# EAGLE design PAPx2-44 (EAGLE 7.2.0)
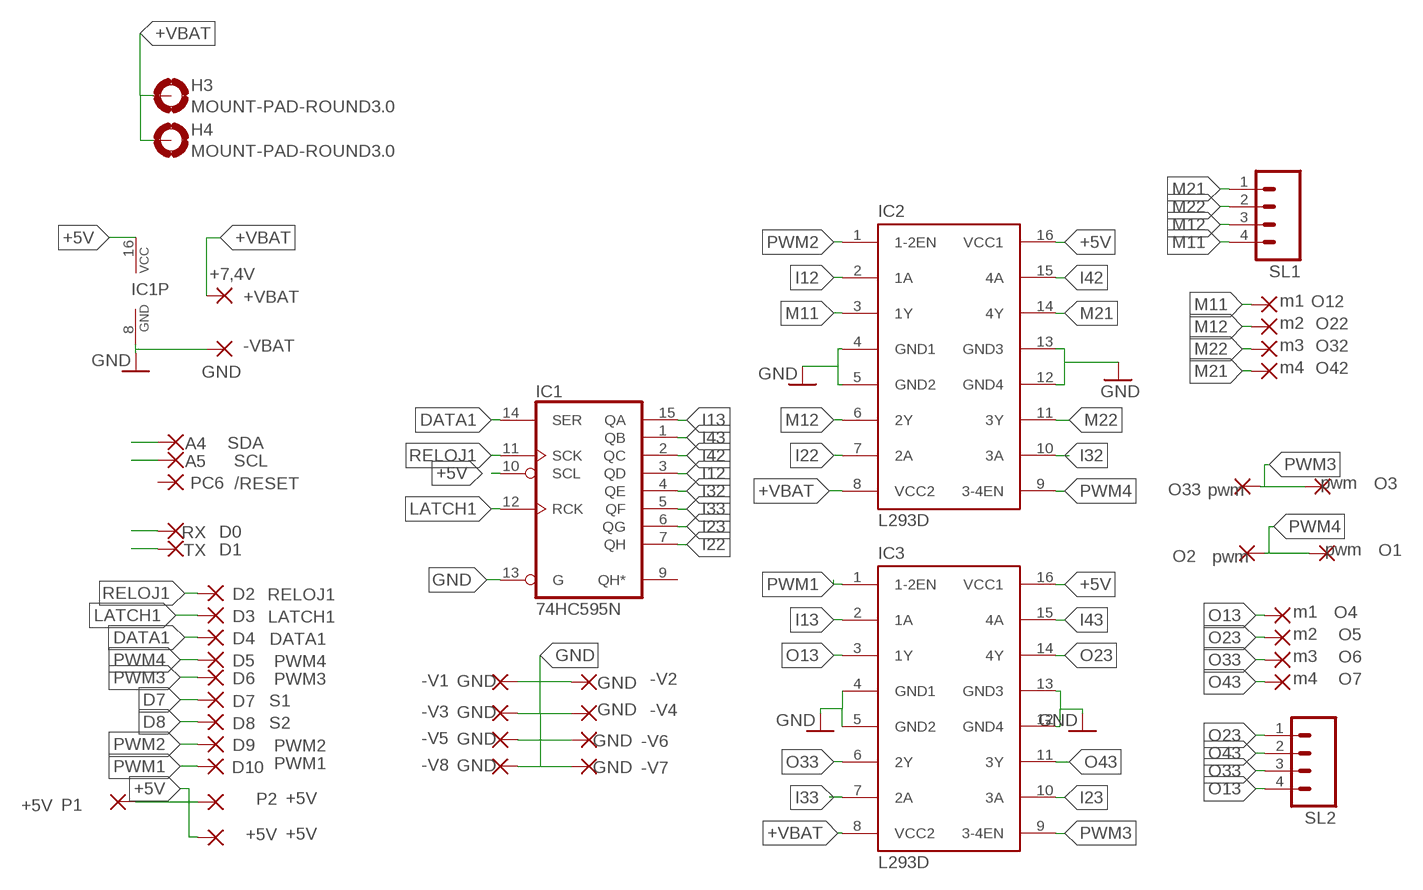
[diagram p0: schematic, sheet 1]

## Parts
+5V  +5V  WIREPAD1,6/0,8  [1,6/0,8]
+VBAT  +7,4V  WIREPAD1,6/0,8  [1,6/0,8]
-V1  GND  WIREPAD1,6/0,8  [1,6/0,8]
-V2  GND  WIREPAD1,6/0,8  [1,6/0,8]
-V3  GND  WIREPAD1,6/0,8  [1,6/0,8]
-V4  GND  WIREPAD1,6/0,8  [1,6/0,8]
-V5  GND  WIREPAD1,6/0,8  [1,6/0,8]
-V6  GND  WIREPAD1,6/0,8  [1,6/0,8]
-V7  GND  WIREPAD1,6/0,8  [1,6/0,8]
-V8  GND  WIREPAD1,6/0,8  [1,6/0,8]
-VBAT  GND  WIREPAD1,6/0,8  [1,6/0,8]
/RESET  PC6  WIREPAD1,6/0,8  [1,6/0,8]
A4  SDA  WIREPAD1,6/0,8  [1,6/0,8]
A5  SCL  WIREPAD1,6/0,8  [1,6/0,8]
D7  S1  WIREPAD1,6/0,8  [1,6/0,8]
D8  S2  WIREPAD1,6/0,8  [1,6/0,8]
DATA1  D4  WIREPAD1,6/0,8  [1,6/0,8]
H3  MOUNT-PAD-ROUND3.0  [3,0-PAD]
H4  MOUNT-PAD-ROUND3.0  [3,0-PAD]
IC1  74HC595N  [DIL16]
IC2  L293D  [DIL16]
IC3  L293D  [DIL16]
LATCH1  D3  WIREPAD1,6/0,8  [1,6/0,8]
O1  pwm  WIREPAD1,6/0,8  [1,6/0,8]
O2  pwm  WIREPAD1,6/0,8  [1,6/0,8]
O3  pwm  WIREPAD1,6/0,8  [1,6/0,8]
O4  m1  WIREPAD1,6/0,8  [1,6/0,8]
O5  m2  WIREPAD1,6/0,8  [1,6/0,8]
O6  m3  WIREPAD1,6/0,8  [1,6/0,8]
O7  m4  WIREPAD1,6/0,8  [1,6/0,8]
O12  m1  WIREPAD1,6/0,8  [1,6/0,8]
O22  m2  WIREPAD1,6/0,8  [1,6/0,8]
O32  m3  WIREPAD1,6/0,8  [1,6/0,8]
O33  pwm  WIREPAD1,6/0,8  [1,6/0,8]
O42  m4  WIREPAD1,6/0,8  [1,6/0,8]
P1  +5V  WIREPAD1,6/0,8  [1,6/0,8]
P2  +5V  WIREPAD1,6/0,8  [1,6/0,8]
PWM1  D10  WIREPAD1,6/0,8  [1,6/0,8]
PWM2  D9  WIREPAD1,6/0,8  [1,6/0,8]
PWM3  D6  WIREPAD1,6/0,8  [1,6/0,8]
PWM4  D5  WIREPAD1,6/0,8  [1,6/0,8]
RELOJ1  D2  WIREPAD1,6/0,8  [1,6/0,8]
RX  D0  WIREPAD1,6/0,8  [1,6/0,8]
SL1  M04  [04P]
SL2  M04  [04P]
TX  D1  WIREPAD1,6/0,8  [1,6/0,8]

## Nets
+5V: +5V.1(P) IC1.10(SCL) IC1.16(VCC) IC2.16(VCC1) IC3.16(VCC1) P1.1(P) P2.1(P)
+VBAT: +VBAT.1(P) H3.B3,0(MOUNT) H4.B3,0(MOUNT) IC2.8(VCC2) IC3.8(VCC2)
D7: D7.1(P)
D8: D8.1(P)
DATA1: DATA1.1(P) IC1.14(SER)
GND: -V1.1(P) -V2.1(P) -V3.1(P) -V4.1(P) -V5.1(P) -V6.1(P) -V7.1(P) -V8.1(P) -VBAT.1(P) IC1.8(GND) IC1.13(G) IC2.4(GND1) IC2.5(GND2) IC2.12(GND4) IC2.13(GND3) IC3.12(GND4) IC3.13(GND3)
I12: IC1.3(QD) IC2.2(1A)
I13: IC1.15(QA) IC3.2(1A)
I22: IC1.7(QH) IC2.7(2A)
I23: IC1.6(QG) IC3.10(3A)
I32: IC1.4(QE) IC2.10(3A)
I33: IC1.5(QF) IC3.7(2A)
I42: IC1.2(QC) IC2.15(4A)
I43: IC1.1(QB) IC3.15(4A)
LATCH1: IC1.12(RCK) LATCH1.1(P)
M11: IC2.3(1Y) O12.1(P) SL1.4
M12: IC2.6(2Y) O22.1(P) SL1.3
M21: IC2.14(4Y) O42.1(P) SL1.1
M22: IC2.11(3Y) O32.1(P) SL1.2
N$1: RX.1(P)
N$2: TX.1(P)
N$3: IC3.4(GND1) IC3.5(GND2) ; supply symbol labelled GND
N$5: A4.1(P)
N$6: A5.1(P)
O13: IC3.3(1Y) O4.1(P) SL2.4
O23: IC3.14(4Y) O5.1(P) SL2.1
O33: IC3.6(2Y) O6.1(P) SL2.3
O43: IC3.11(3Y) O7.1(P) SL2.2
PWM1: IC3.1(1-2EN) PWM1.1(P)
PWM2: IC2.1(1-2EN) PWM2.1(P)
PWM3: IC3.9(3-4EN) O3.1(P) O33.1(P) PWM3.1(P)
PWM4: IC2.9(3-4EN) O1.1(P) O2.1(P) PWM4.1(P)
RELOJ1: IC1.11(SCK) RELOJ1.1(P)
Unconnected: /RESET.1(P) IC1.9(QH*)

## Library data of the parts
+5V +VBAT -V1--V8 -VBAT /RESET A4 A5 D7 D8 DATA1 LATCH1 O1-O7 O12 O22 O32 O33 O42 P1 P2 PWM1-PWM4 RELOJ1 RX TX = wirepad:WIREPAD: Wire PAD connect wire on PCB
H3 H4 = holes:MOUNT-PAD-ROUND: MOUNTING PAD, round
IC1 = 74xx-eu:74*595: 8-bit SHIFT REGISTER, output latch
IC2 IC3 = treser_lib:L293D: Driver L293D Driver PUSH-PULL de 4 canales; MPN: L293D; OC_FARNELL: 9589619; OC_NEWARK: 56P8249
SL1 SL2 = con-amp-quick:M04: AMP QUICK CONNECTOR; OC_FARNELL: unknown; OC_NEWARK: unknown

## Board
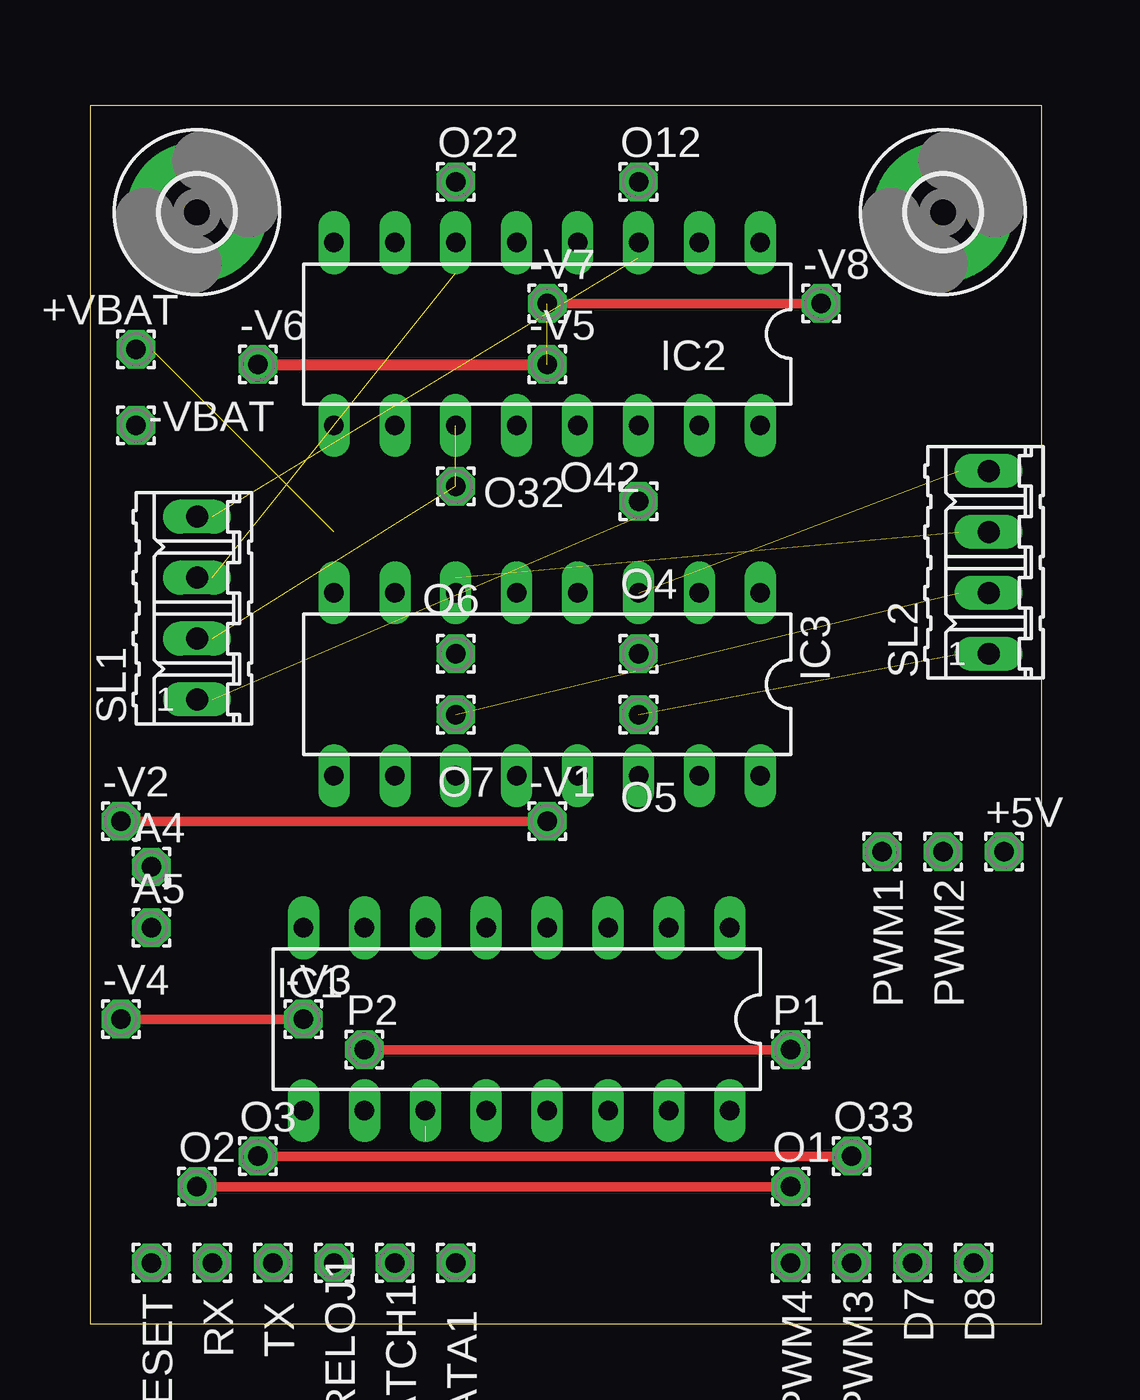
[diagram p1: board, top side]
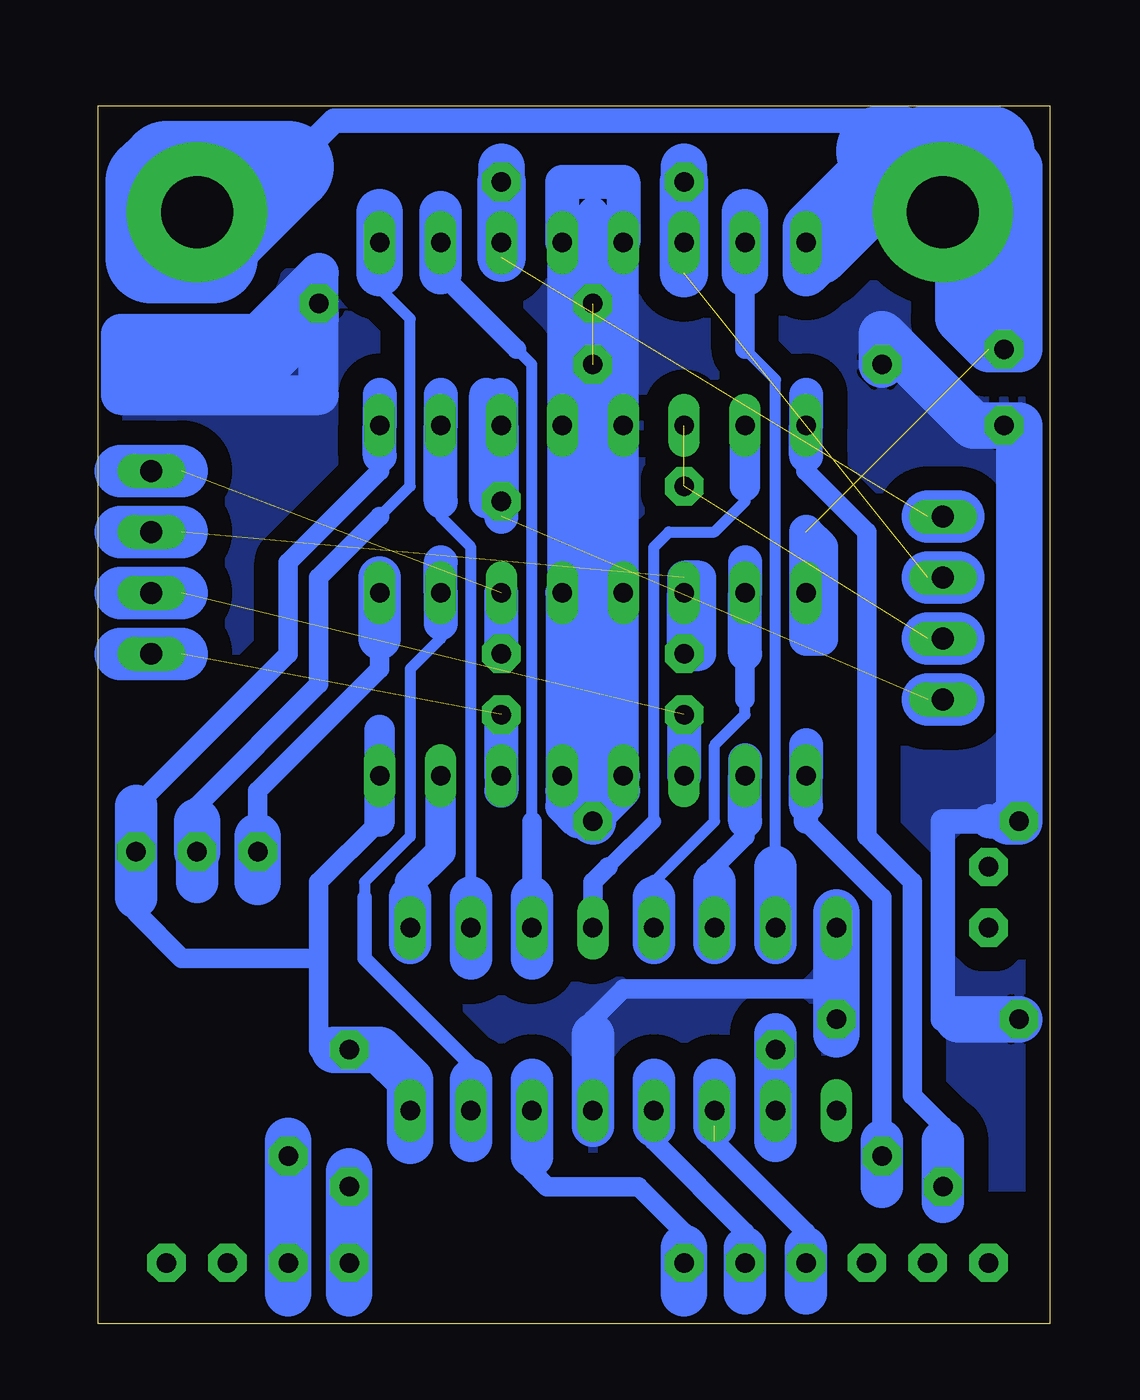
[diagram p2: board, bottom side, seen from below]

Size 39.67 x 50.79 mm. Coordinates in mm from the lower left corner, seen from the top.
Outline: 0,0 39.67,0 39.67,50.79 0,50.79 0,0
Copper layers (1*16): Top 0.035mm / dielectric 1.5mm / Bottom 0.035mm
Design rules "default": minimum track width 10mil, minimum drill 24mil, track to track 8mil, track to pad 8mil, pad to pad 8mil, via to via 8mil, smd to smd 8mil, copper to edge 40mil, drill to drill 8mil, minimum pad ring 10mil, minimum via ring 8mil, stop-mask expansion 4mil, vias tented up to drill 0mil, thermal gap 10mil

### Footprints (pad centres in the part's own frame; a part is rotated, then mirrored left to right if it is on the bottom)
1,6/0,8 = drill 0.813 pad 1.6 octagon: 1 0,0
3,0-PAD = drill 3 pad 5.842: B3,0 0,0
DIL16 = drill 0.813 long: 1 -8.89,-3.81; 2 -6.35,-3.81; 3 -3.81,-3.81; 4 -1.27,-3.81; 5 1.27,-3.81; 6 3.81,-3.81; 7 6.35,-3.81; 8 8.89,-3.81; 9 8.89,3.81; 10 6.35,3.81; 11 3.81,3.81; 12 1.27,3.81; 13 -1.27,3.81; 14 -3.81,3.81; 15 -6.35,3.81; 16 -8.89,3.81
04P = drill 0.914 long: 1 -3.81,0; 2 -1.27,0; 3 1.27,0; 4 3.81,0

### Placement (x,y rotation side)
+5V  38.1,19.69 0 top
+VBAT  1.91,40.64 0 top
-V1  19.05,20.96 0 top
-V2  1.27,20.96 0 top
-V3  8.89,12.7 0 top
-V4  1.27,12.7 0 top
-V5  19.05,40.01 0 top
-V6  6.99,40.01 0 top
-V7  19.05,42.55 0 top
-V8  30.48,42.55 0 top
-VBAT  1.91,37.47 0 top
/RESET  2.54,2.54 0 top
A4  2.54,19.05 0 top
A5  2.54,16.51 0 top
D7  34.29,2.54 0 top
D8  36.83,2.54 0 top
DATA1  15.24,2.54 0 top
H3  35.56,46.36 0 top
H4  4.45,46.36 0 top
IC1  17.78,12.7 180 top
IC2  19.05,41.27 180 top
IC3  19.05,26.67 180 top
LATCH1  12.7,2.54 0 top
O1  29.21,5.71 0 top
O2  4.45,5.71 0 top
O3  6.99,6.99 0 top
O4  22.86,27.94 0 top
O5  22.86,25.4 0 top
O6  15.24,27.94 0 top
O7  15.24,25.4 0 top
O12  22.86,47.62 0 top
O22  15.24,47.62 0 top
O32  15.24,34.92 0 top
O33  31.75,6.99 0 top
O42  22.86,34.29 0 top
P1  29.21,11.43 0 top
P2  11.43,11.43 0 top
PWM1  33.02,19.69 0 top
PWM2  35.56,19.69 0 top
PWM3  31.75,2.54 0 top
PWM4  29.21,2.54 0 top
RELOJ1  10.16,2.54 0 top
RX  5.08,2.54 0 top
SL1  4.45,29.84 90 top
SL2  37.47,31.75 90 top
TX  7.62,2.54 0 top

### Tracks (layer width: path | path; a pad name or v marks a point on that pad's centre or on a via)
+5V
  Top 0.406: P1.1 P2.1
  Bottom 0.813: 29.84,11.43 30.48,11.43 30.48,15.24 | 30.48,15.24 30.48,18.41 27.94,20.96 27.94,22.23 | 30.48,15.24 36.2,15.24 38.1,17.14 38.1,17.78 | 38.1,21.59 31.75,27.94 31.75,31.75 27.94,35.56 27.94,36.2
  Bottom 1.27: 27.94,22.23 IC3.16 | IC3.16 27.94,20.96 | 27.94,24.77 IC3.16
  Bottom 1.422: 27.94,36.2 IC2.16 27.94,38.73
  Bottom 1.778: 11.43,7.62 IC1.10 P2.1 11.43,12.07 | 38.1,17.78 +5V.1 38.1,21.59
  Bottom 1.93: 26.67,7.62 IC1.16 26.67,10.16 27.94,11.43 P1.1 29.84,11.43
+VBAT  (1 unrouted)
  Bottom 1.016: 6.35,48.9 7.62,50.16 29.84,50.16 31.75,48.26
  Bottom 1.422: IC3.8 10.16,28.58 9.53,28.58 9.53,32.38 10.16,33.02 IC3.8
  Bottom 1.93: 9.53,44.45 10.16,43.81 IC2.8 | IC2.8 10.16,45.72 7.62,48.26 7.62,47.62 IC2.8 | +VBAT.1 1.27,40.64 1.27,48.26 2.54,49.53 2.54,45.09 3.81,43.81 3.81,41.91 2.54,40.64 +VBAT.1 | +VBAT.1 1.91,43.81 H4.B3,0
  Bottom 2.184: H4.B3,0 7.62,46.36 9.53,44.45
  Bottom 3.81: H4.B3,0 4.45,46.99 6.35,48.9 | 33.66,48.26 36.83,48.26 37.47,47.62 37.47,44.45 34.92,44.45 34.92,45.09 31.75,48.26 33.66,48.26 | 33.66,48.26 H3.B3,0 | H4.B3,0 4.45,48.26 5.08,48.9 2.54,48.9 2.54,44.45 | 2.54,43.18 2.54,44.45 | 2.54,44.45 H4.B3,0 | 6.99,48.9 H4.B3,0
DATA1
  Bottom 0.813: 15.24,3.17 15.24,3.81 17.14,5.71 20.95,5.71 21.59,6.35 21.59,6.99
  Bottom 1.778: 21.59,6.99 IC1.14 21.59,10.16
  Bottom 1.93: 15.24,1.27 DATA1.1 15.24,3.17
GND  (1 unrouted)
  Top 0.406: -V1.1 -V2.1 | -V3.1 -V4.1 | -V7.1 -V8.1
  Top 0.457: -V6.1 -V5.1
  Bottom 0.813: 8.89,14.61 9.53,13.97 17.78,13.97 19.05,12.7 19.05,12.07
  Bottom 1.016: 3.81,12.7 4.45,12.7 4.45,20.96 2.54,20.96
  Bottom 1.27: IC3.13 IC2.13 IC2.4 | IC2.5 IC2.12 IC3.12
  Bottom 1.422: IC2.4 20.32,47.62 17.78,47.62 IC2.5 | 19.05,22.86 IC3.12 | 2.54,20.96 1.73,20.96
  Bottom 1.676: -V8.1 30.48,43.81 33.02,41.27 38.73,41.27 38.73,38.73 30.48,38.73 -V8.1 | -V8.1 30.48,41.91 32.38,40.01 38.1,40.01
  Bottom 1.778: IC1.8 8.89,14.61 | 19.05,12.07 IC1.13 19.05,8.25
  Bottom 1.93: 8.89,12.07 -V3.1 IC1.8 8.89,17.14 | -V1.1 19.05,22.86 | -V4.1 3.81,12.7 | 1.73,20.96 -V2.1 1.27,37.47 -VBAT.1 3.17,37.47 6.99,41.27 -V6.1
  pour Bottom (isolate 1.016): 0,5.71 39.37,5.71 39.37,43.81 0,43.81
I12
  Bottom 0.457: 21.59,20.96 21.59,40.01 22.23,40.64
  Bottom 0.813: 21.59,17.78 21.59,20.96 | 22.23,40.64 25.4,43.81
  Bottom 1.778: 21.59,15.24 IC1.3 21.59,17.78 | 25.4,43.81 IC2.2 25.4,46.36
I13
  Bottom 0.457: 25.4,29.21 25.4,28.58 26.67,27.3 26.67,20.32 28.57,18.41 28.57,17.78
  Bottom 0.61: 28.57,17.78 28.57,15.24 24.13,10.8 24.13,10.16
  Bottom 1.422: 25.4,31.75 IC3.2 25.4,29.21
  Bottom 1.778: 24.13,7.62 IC1.15 24.13,10.16
I22
  Bottom 0.457: 11.43,19.05 11.43,39.37 12.7,40.64
  Bottom 0.813: 12.7,40.64 IC2.7
  Bottom 1.778: 11.43,15.88 IC1.7 11.43,19.05
  Bottom 1.93: 12.7,43.81 IC2.7 12.7,46.36
I23
  Bottom 0.813: 13.97,18.41 13.97,19.05 12.7,20.32 12.7,20.96
  Bottom 1.422: 12.7,20.96 IC3.10 12.7,23.5
  Bottom 1.778: 13.97,15.88 IC1.6 13.97,18.41
I32
  Bottom 0.457: 16.51,20.96 16.51,32.38 15.88,33.02 13.97,33.02 12.7,34.29 12.7,34.92
  Bottom 0.61: 18.41,19.05 16.51,20.96
  Bottom 0.813: IC1.4 19.05,18.41 18.41,19.05
  Bottom 1.27: 12.7,34.92 IC2.10
I33
  Bottom 0.457: 16.51,18.41 13.97,20.96 13.97,24.13 12.7,25.4 12.7,26.04
  Bottom 0.61: 16.51,17.78 16.51,18.41
  Bottom 0.813: IC1.5 16.51,17.14 | 12.7,26.04 12.7,27.94
  Bottom 1.422: 12.7,27.94 IC3.7 12.7,31.75
  Bottom 1.778: 16.51,15.88 16.51,17.14 16.51,17.78
I42
  Bottom 0.457: 24.13,17.78 24.13,32.38 25.4,33.66 25.4,34.29
  Bottom 1.422: 25.4,34.29 IC2.15 25.4,38.73
  Bottom 1.778: 24.13,15.24 IC1.2 24.13,17.78
I43
  Bottom 1.27: 26.67,17.78 26.67,18.41 25.4,19.69 IC3.15
  Bottom 1.778: 26.67,15.88 IC1.1 26.67,17.78
LATCH1
  Bottom 0.813: 16.51,8.25 16.51,7.62 12.7,3.81 12.7,3.17
  Bottom 1.778: 16.51,10.16 IC1.12 16.51,8.25 | 12.7,3.17 LATCH1.1 12.7,1.27
M11  (1 unrouted)
  Bottom 1.93: 22.86,48.26 O12.1
  Bottom 2.032: 22.86,44.45 IC2.3 O12.1
  Bottom 2.184: 3.81,33.66 SL1.4 5.08,33.66
M12  (1 unrouted)
  Bottom 1.93: 15.24,48.26 O22.1
  Bottom 2.032: 15.24,43.81 IC2.6 O22.1
  Bottom 2.184: 3.81,31.12 SL1.3 5.08,31.12
M21  (1 unrouted)
  Bottom 1.422: 22.86,38.73 IC2.14 O42.1 | 22.86,33.66 O42.1 | O42.1 23.5,34.29 23.5,38.73
  Bottom 2.184: 3.81,26.04 SL1.1 5.08,26.04
M22  (2 unrouted)
  Bottom 2.184: 3.81,28.58 SL1.2 5.08,28.58
N$3
  Bottom 1.27: 19.05,31.75 19.05,24.13 20.32,22.86 18.41,22.86 17.78,22.86 IC3.5 19.05,31.75 | 19.05,46.36 19.05,31.75
  Bottom 1.422: IC3.4 20.32,22.23 | 20.32,22.23 20.32,21.59 19.68,20.96 19.05,20.96 17.78,22.23 19.68,22.23 | 20.32,22.23 19.68,22.23 | 19.68,22.23 18.41,23.5 18.41,22.86
O13  (1 unrouted)
  Bottom 1.422: O4.1 IC3.3
  Bottom 2.184: 38.73,35.56 SL2.4 36.2,35.56
O23  (1 unrouted)
  Bottom 1.422: 22.86,22.23 IC3.14 O5.1
  Bottom 2.184: 38.73,27.94 SL2.1 36.2,27.94
O33  (1 unrouted)
  Bottom 1.422: O6.1 14.61,27.94 14.61,31.12 15.24,31.12 IC3.6 O6.1
  Bottom 2.184: 38.73,33.02 SL2.3 36.2,33.02
O43  (1 unrouted)
  Bottom 1.422: O7.1 IC3.11
  Bottom 2.184: 38.73,30.48 SL2.2 36.2,30.48
PWM1
  Bottom 0.813: 33.02,20.32 33.02,22.23 27.94,27.3 27.94,28.58
  Bottom 1.778: 27.94,28.58 IC3.1 27.94,31.12
  Bottom 1.93: 33.02,18.41 PWM1.1 33.02,20.32
PWM2
  Bottom 0.457: 27.94,43.81 27.94,43.18 26.67,41.91 26.67,34.92 27.94,33.66
  Bottom 0.813: 35.56,20.96 35.56,21.59 30.48,26.67 30.48,31.12 27.94,33.66
  Bottom 1.778: PWM2.1 35.56,18.41
  Bottom 1.93: 27.94,46.36 IC2.1 27.94,43.81 | 35.56,20.96 PWM2.1
PWM3
  Top 0.406: O3.1 O33.1
  Bottom 0.813: 6.99,7.62 6.99,17.78 10.16,20.96
  Bottom 1.016: 10.16,20.96 10.16,21.59
  Bottom 1.422: 10.16,21.59 IC3.9 10.16,24.13
  Bottom 1.778: 6.99,5.71 O3.1 6.99,7.62
  Bottom 1.93: 31.75,7.62 O33.1 PWM3.1 31.75,1.27
PWM4
  Top 0.406: O1.1 O2.1
  Bottom 0.813: 4.45,7.62 4.45,8.25 5.71,9.53 5.71,18.41 7.62,20.32 7.62,33.02 10.16,35.56 10.16,36.2
  Bottom 1.422: 10.16,36.2 IC2.9 10.16,38.73
  Bottom 1.778: 4.45,5.08 O2.1 4.45,7.62
  Bottom 1.93: 29.21,1.27 PWM4.1 O1.1 29.21,6.35
RELOJ1  (1 unrouted)
  Bottom 0.61: 10.16,3.17 10.16,3.81
  Bottom 0.813: 10.16,3.81 13.97,7.62
  Bottom 1.778: 10.16,1.27 RELOJ1.1 10.16,3.17 | 13.97,10.16 IC1.11 13.97,8.25